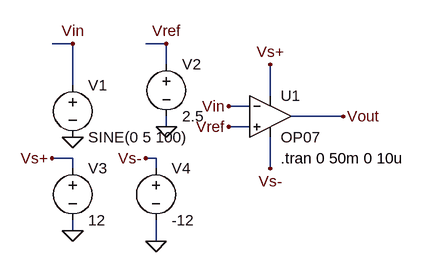
[diagram p0: schematic Task 2.asc]
Task 2.asc, the LTspice schematic file:
Version 4
SHEET 1 880 680
WIRE 112 0 80 0
WIRE 256 0 224 0
WIRE 256 32 256 0
WIRE 112 64 112 0
WIRE 416 80 416 32
WIRE 384 96 352 96
WIRE 528 112 448 112
WIRE 256 128 256 112
WIRE 384 128 352 128
WIRE 112 176 80 176
WIRE 240 176 224 176
WIRE 112 192 112 176
WIRE 240 192 240 176
WIRE 416 192 416 144
WIRE 112 288 112 272
WIRE 240 304 240 272
FLAG 112 288 0
FLAG 256 128 0
FLAG 240 304 0
FLAG 112 144 0
FLAG 80 176 Vs+
FLAG 224 176 Vs-
FLAG 112 0 Vin
FLAG 256 0 Vref
FLAG 528 112 Vout
FLAG 352 96 Vin
FLAG 352 128 Vref
FLAG 416 32 Vs+
FLAG 416 192 Vs-
SYMBOL voltage 112 48 R0
WINDOW 123 0 0 Left 0
WINDOW 39 0 0 Left 0
SYMATTR InstName V1
SYMATTR Value SINE(0 5 100)
SYMBOL voltage 112 176 R0
SYMATTR InstName V3
SYMATTR Value 12
SYMBOL voltage 240 176 R0
WINDOW 123 0 0 Left 0
WINDOW 39 0 0 Left 0
SYMATTR InstName V4
SYMATTR Value -12
SYMBOL OpAmps\\OP07 416 48 R0
SYMATTR InstName U1
SYMBOL voltage 256 16 R0
SYMATTR InstName V2
SYMATTR Value 2.5
TEXT 432 176 Left 2 !.tran 0 50m 0 10u

The netlist it stands for:
* Task 2.asc
V1 Vin 0 SINE(0 5 100)
V3 Vs+ 0 12
V4 Vs- 0 -12
XU1 Vref Vin Vs+ Vs- Vout LT1001  ; OP07, pins In+ In- V+ V- OUT
V2 Vref 0 2.5
.tran 0 50m 0 10u
.lib LTC.lib
.backanno
.end